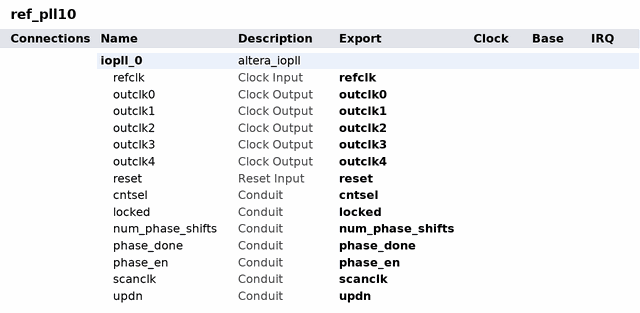
[diagram p0: system contents]
# Platform Designer (Qsys) system ref_pll10, Arria 10 10AS066N3F40E2SG
# Parameters at their usual value, and those the tool derives, are not listed.
package require -exact qsys 16.0
create_system ref_pll10
set_project_property DEVICE_FAMILY {Arria 10}
set_project_property DEVICE 10AS066N3F40E2SG

add_instance iopll_0 altera_iopll 16.0
set_instance_property iopll_0 AUTO_EXPORT true
set_instance_parameter_value iopll_0 gui_actual_duty_cycle0 50.0
set_instance_parameter_value iopll_0 gui_actual_duty_cycle1 50.0
set_instance_parameter_value iopll_0 gui_actual_duty_cycle2 50.0
set_instance_parameter_value iopll_0 gui_actual_duty_cycle3 50.0
set_instance_parameter_value iopll_0 gui_actual_duty_cycle4 31.25
set_instance_parameter_value iopll_0 gui_actual_output_clock_frequency0 100.0
set_instance_parameter_value iopll_0 gui_actual_output_clock_frequency1 100.0
set_instance_parameter_value iopll_0 gui_actual_output_clock_frequency2 100.0
set_instance_parameter_value iopll_0 gui_actual_output_clock_frequency3 100.0
set_instance_parameter_value iopll_0 gui_actual_output_clock_frequency4 100.0
set_instance_parameter_value iopll_0 gui_actual_phase_shift0 0.0
set_instance_parameter_value iopll_0 gui_actual_phase_shift1 0.0
set_instance_parameter_value iopll_0 gui_actual_phase_shift2 0.0
set_instance_parameter_value iopll_0 gui_actual_phase_shift3 0.0
set_instance_parameter_value iopll_0 gui_actual_phase_shift4 0.0
set_instance_parameter_value iopll_0 gui_actual_phase_shift_deg0 0.0
set_instance_parameter_value iopll_0 gui_actual_phase_shift_deg1 0.0
set_instance_parameter_value iopll_0 gui_actual_phase_shift_deg2 0.0
set_instance_parameter_value iopll_0 gui_actual_phase_shift_deg3 0.0
set_instance_parameter_value iopll_0 gui_actual_phase_shift_deg4 0.0
set_instance_parameter_value iopll_0 gui_clock_name_global false
set_instance_parameter_value iopll_0 gui_clock_to_compensate 0
set_instance_parameter_value iopll_0 gui_device_speed_grade 1
set_instance_parameter_value iopll_0 gui_divide_factor_c0 8
set_instance_parameter_value iopll_0 gui_divide_factor_c1 5
set_instance_parameter_value iopll_0 gui_divide_factor_c2 40
set_instance_parameter_value iopll_0 gui_divide_factor_c3 1
set_instance_parameter_value iopll_0 gui_divide_factor_c4 8
set_instance_parameter_value iopll_0 gui_duty_cycle4 12.5
set_instance_parameter_value iopll_0 gui_en_adv_params true
set_instance_parameter_value iopll_0 gui_en_dps_ports true
set_instance_parameter_value iopll_0 gui_en_lvds_ports Disabled
set_instance_parameter_value iopll_0 gui_existing_mif_file_path {~/pll.mif}
set_instance_parameter_value iopll_0 gui_lock_setting {Low Lock Time}
set_instance_parameter_value iopll_0 gui_mif_config_name unnamed
set_instance_parameter_value iopll_0 gui_mif_gen_options {Generate New MIF File}
set_instance_parameter_value iopll_0 gui_multiply_factor 8
set_instance_parameter_value iopll_0 gui_new_mif_file_path {~/pll.mif}
set_instance_parameter_value iopll_0 gui_number_of_clocks 5
set_instance_parameter_value iopll_0 gui_operation_mode lvds
set_instance_parameter_value iopll_0 gui_output_clock_frequency0 100.0
set_instance_parameter_value iopll_0 gui_output_clock_frequency1 100.0
set_instance_parameter_value iopll_0 gui_output_clock_frequency2 100.0
set_instance_parameter_value iopll_0 gui_output_clock_frequency3 100.0
set_instance_parameter_value iopll_0 gui_phase_shift4 0.0
set_instance_parameter_value iopll_0 gui_reference_clock_frequency 125.0
set_instance_parameter_value iopll_0 gui_use_NDFB_modes false
set_instance_parameter_value iopll_0 gui_use_locked true
set_instance_parameter_value iopll_0 gui_vco_frequency 600.0
set_instance_parameter_value iopll_0 system_info_device_component 10AS066N3F40E2SG
set_instance_parameter_value iopll_0 system_info_device_speed_grade 2
set_instance_parameter_value iopll_0 system_part_trait_speed_grade 3

# exported interfaces
add_interface cntsel conduit end
set_interface_property cntsel EXPORT_OF iopll_0.cntsel
add_interface locked conduit end
set_interface_property locked EXPORT_OF iopll_0.locked
add_interface num_phase_shifts conduit end
set_interface_property num_phase_shifts EXPORT_OF iopll_0.num_phase_shifts
add_interface outclk0 clock source
set_interface_property outclk0 EXPORT_OF iopll_0.outclk0
add_interface outclk1 clock source
set_interface_property outclk1 EXPORT_OF iopll_0.outclk1
add_interface outclk2 clock source
set_interface_property outclk2 EXPORT_OF iopll_0.outclk2
add_interface outclk3 clock source
set_interface_property outclk3 EXPORT_OF iopll_0.outclk3
add_interface outclk4 clock source
set_interface_property outclk4 EXPORT_OF iopll_0.outclk4
add_interface phase_done conduit end
set_interface_property phase_done EXPORT_OF iopll_0.phase_done
add_interface phase_en conduit end
set_interface_property phase_en EXPORT_OF iopll_0.phase_en
add_interface refclk clock sink
set_interface_property refclk EXPORT_OF iopll_0.refclk
add_interface reset reset sink
set_interface_property reset EXPORT_OF iopll_0.reset
add_interface scanclk conduit end
set_interface_property scanclk EXPORT_OF iopll_0.scanclk
add_interface updn conduit end
set_interface_property updn EXPORT_OF iopll_0.updn

set_interconnect_requirement {$system} qsys_mm.clockCrossingAdapter HANDSHAKE
set_interconnect_requirement {$system} qsys_mm.enableEccProtection FALSE
set_interconnect_requirement {$system} qsys_mm.insertDefaultSlave FALSE
set_interconnect_requirement {$system} qsys_mm.maxAdditionalLatency 1

save_system ref_pll10.qsys
